# Altium schematic sheet Sheet2.SchDoc
size A; Author: NTD; SheetNumber: 1; SheetTotal: 1; Time: DC motor
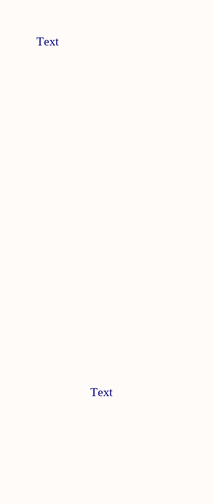
[diagram p0: Sheet2.SchDoc, left]
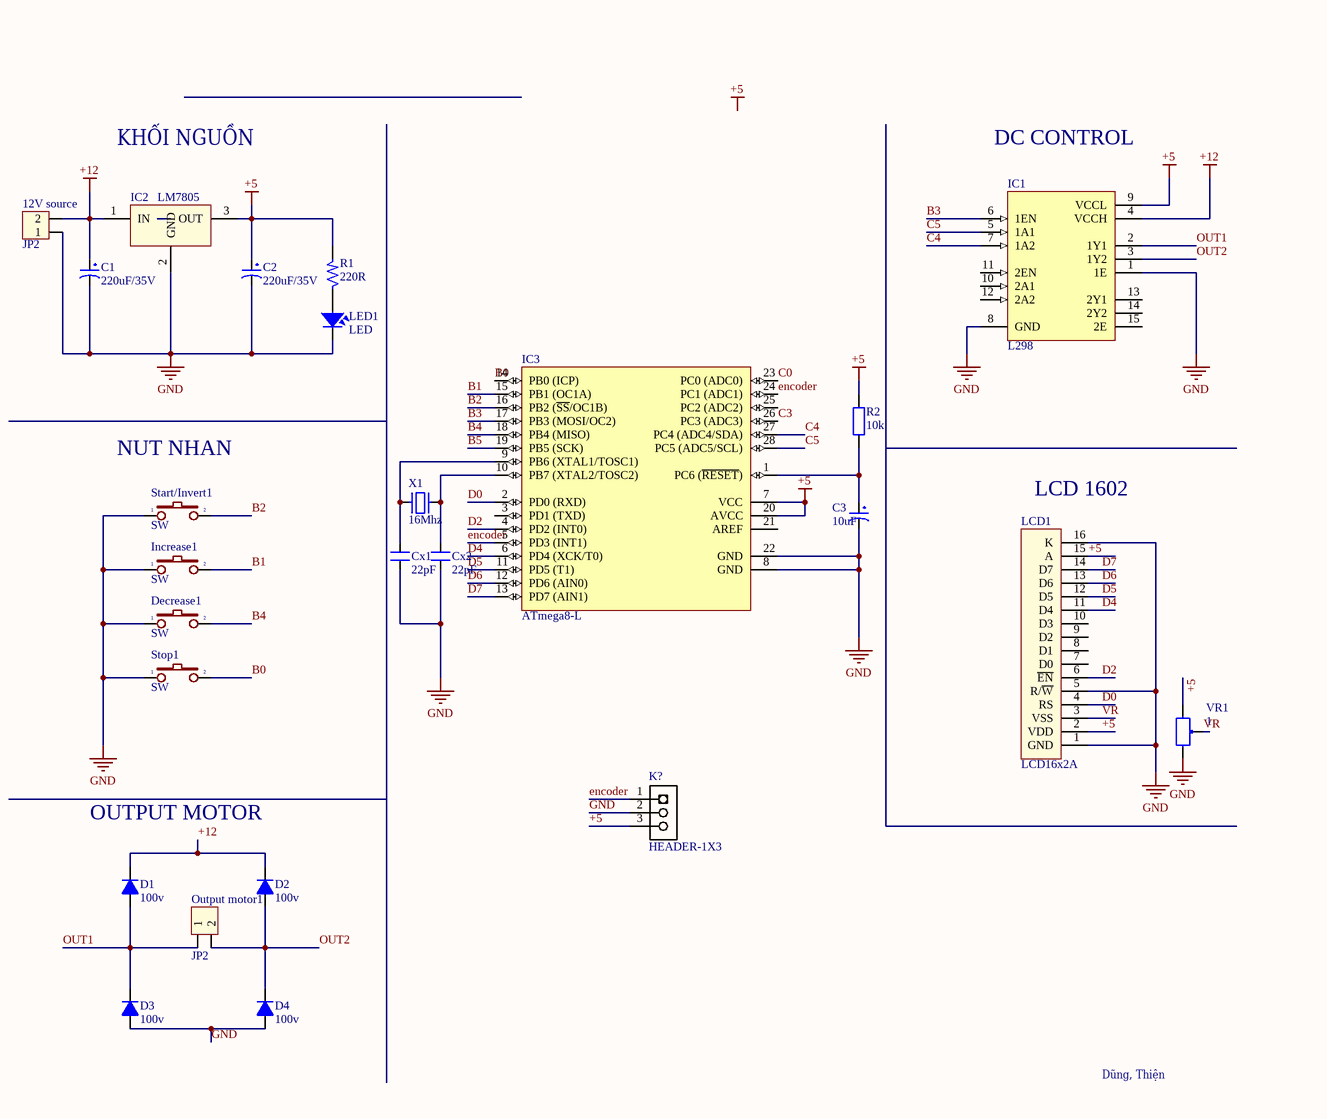
[diagram p1: Sheet2.SchDoc, right]

## Parts
12V_source  JP2  [CON2]
C1  220uF/35V  [CP1.5/3.4]
C2  220uF/35V  [CP1.5/3.4]
C3  10uF  [CP1/2]
Cx1  22pF  [CN1]
Cx2  22pF  [CN1]
D1  100v  [DIODE 0.5A]
D2  100v  [DIODE 0.5A]
D3  100v  [DIODE 0.5A]
D4  100v  [DIODE 0.5A]
Decrease1  SW  [SW2]
IC1  L298  [DIP15SL2]
IC2  LM7805  [QTO-220]
IC3  ATmega8-L  [DIP28/W0.3]
Increase1  SW  [SW2]
K?  HEADER-1X3  [HEADER-1X3]
LCD1  LCD16x2A  [LCD16X2]
LED1  LED  [LED-3]
Output_motor1  JP2  [CON2]
R1  220R  [R1/4W]
R2  10k  [tro vach 1/2w]
Start/Invert1  SW  [SW2]
Stop1  SW  [SW2]
VR1  1  [BIEN TRO VI CHINH NAM]
X1  16Mhz  [XT2]

## Nets
+5: C2.1 IC1.9(VCCL) IC2.3(OUT) IC3.7(VCC) IC3.20(AVCC) K?.3 LCD1.2(VDD) LCD1.15(A) R1.2 R2.2 VR1.1  [also labelled \]
+12: 12V_source.2 C1.1 D1.2(K) D2.2(K) IC1.4(VCCH) IC2.1(IN)
GND: 12V_source.1 C1.2 C2.2 C3.2 Cx1.1 Cx2.1 D3.1(A) D4.1(A) Decrease1.1 IC1.1(1E) IC1.8(GND) IC2.2(GND) IC3.8(GND) IC3.22(GND) Increase1.1 K?.2 LCD1.1(GND) LCD1.5(R/~{W}) LCD1.16(K) LED1.2 Start/Invert1.1 Stop1.1 VR1.3
B0: IC3.14(PB0_(ICP)) Stop1.2
B1: IC3.15(PB1_(OC1A)) Increase1.2
B2: IC3.16(PB2_(~{SS}/OC1B)) Start/Invert1.2
B3: IC1.6(1EN) IC3.17(PB3_(MOSI/OC2))
B4: Decrease1.2 IC3.18(PB4_(MISO))
B5: IC3.19(PB5_(SCK))
C0: IC3.23(PC0_(ADC0))
C3: IC3.26(PC3_(ADC3))
C4: IC1.7(1A2) IC3.27(PC4_(ADC4/SDA))
C5: IC1.5(1A1) IC3.28(PC5_(ADC5/SCL))
D0: IC3.2(PD0_(RXD)) LCD1.4(RS)
D2: IC3.4(PD2_(INT0)) LCD1.6(~{EN})
D4: IC3.6(PD4_(XCK/T0)) LCD1.11(D4)
D5: IC3.11(PD5_(T1)) LCD1.12(D5)
D6: IC3.12(PD6_(AIN0)) LCD1.13(D6)
D7: IC3.13(PD7_(AIN1)) LCD1.14(D7)
encoder: IC3.5(PD3_(INT1)) IC3.24(PC1_(ADC1)) K?.1
OUT1: D1.1(A) D3.2(K) IC1.2(1Y1) Output_motor1.1
OUT2: D2.1(A) D4.2(K) IC1.3(1Y2) Output_motor1.2
VR: LCD1.3(VSS) VR1.2
NetC3_1: C3.1 IC3.1(PC6_(~{RESET})) R2.1
NetCx1_2: Cx1.2 IC3.9(PB6_(XTAL1/TOSC1)) X1.1
NetCx2_2: Cx2.2 IC3.10(PB7_(XTAL2/TOSC2)) X1.2
NetLED1_1: LED1.1 R1.1

Not connected (* = marked no-connect by the designer): IC1 10(2A1) 11(2EN) 12(2A2) 13(2Y1) 14(2Y2) 15(2E); IC3 3(PD1_(TXD)) 21(AREF) 25(PC2_(ADC2)); LCD1 7(D0) 8(D1) 9(D2) 10(D3)

## Notes on the sheet
- Text
- KHỐI NGUỒN
- DC CONTROL
- NUT NHAN
- (near LCD1) LCD 1602
- OUTPUT MOTOR
- Dũng, Thiện
- Labels drawn without touching a wire or pin: +5

## Library data of the parts
12V_source Output_motor1 = Con2: Connector 2; Value: Connector 2
C1 C2 = CP3: Cap 100uF/35V - 470uF/16V; Value: 100uF/35V/50V; Description 1: 1000uF/6,3V - 470uF/16V - 330uF - 25V; Description 2: 220uF/35V - 100uF/50V - 63V - 4,7uF/200V; Description 3: 22uF => 33uF100V - 3,3uF => 4,7uF/250V; Description 4: 2,2uF =>3,3uF/350 - 2,2uF/400V - 1uF/450V
C3 = CP1: Cap P  0,1uF < 22uF , 16 - 50V; Value: 10uF/50V; Description 1: 10 => 220uF/6,3V/10V - 10uF => 100uF/16V; Description 2: 0,1uF => 33uF/50V - 10uF => 22uF/63V; Description 3: 0,47uF => 10uF/100V
Cx1 Cx2 = CN0: Cremic For Xtal 1pF => 100pF; Value: 33pF
D1-D4 = Diode 1N4148: Cắm; Ten_Linh_Kien: Diode 1N4148 DO35 450mA 100V ( 1N4148 DIP); Don_Vi: Con; Ma_Hang: MH001065; Ghi Chu: *; Kieu_Chan: *; Chung_Loai: Cắm
Decrease1 Increase1 Start/Invert1 Stop1 = SW2: Switch button 2 pin; Value: SW chip 2 pin
IC1 = L298: Dual Full-H Driver; Note: The tab is elec is connected to GND pin; Published: 15-May-2002; DatasheetVersion: Jun-1990; PackageReference: KV015; Publisher: Altium Limited; PackageDescription: TO, Thru-Hole, Vertical, Heatsink Mounted; 15 Bent Staggered Leads; Pitch 1.27 mm; ComponentLink1Description: Manufacturer Link; ComponentLink1URL: http://www.ti.com/
IC2 = LM78xx: On ap +, from + 5 to + 24VDC; Value: LM7805
IC3 = ATmega8-L: 8-Bit AVR Microcontroller with 8K Bytes of In-System Programmable Flash Memory; Value: ATmega8-L
LCD1 = LCD16x2: LCD dipslay 16 char, 2 line; Value: LCD16x2A
LED1 = LED: LED Single colour Green and Red; Value: LED 3 ly Single Colour
R1 = R: Resistor 1/4W; Value: R1/4W - 1K
R2 = Tro Vach 1/2W 5% 10k: Cắm; Don_Vi: Con; So_Chan: 2; Ten_Linh_Kien: Trở 5% 1/2w 10k; Ma_Hang: MH006206; Chung_Loai: Cắm; Kieu_Chan: *
VR1 = Bien Tro Tinh Chinh 1K Nam: Cắm; Don_Vi: Con; Ten_Linh_Kien: Biến Trở VR 102-1K 3296W; Ma_Hang: MH003234; Kieu_Chan: *; Chung_Loai: Cắm
X1 = XT2: Crystal For all Crystal 2pin.; Value: 4Mhz
K? = HEADER-1X3: Supplier 1: Digi-Key; Supplier Part Number 1: S1011E-36-ND